# EAGLE schematic digital-logic _ analog (EAGLE 6.5.0)
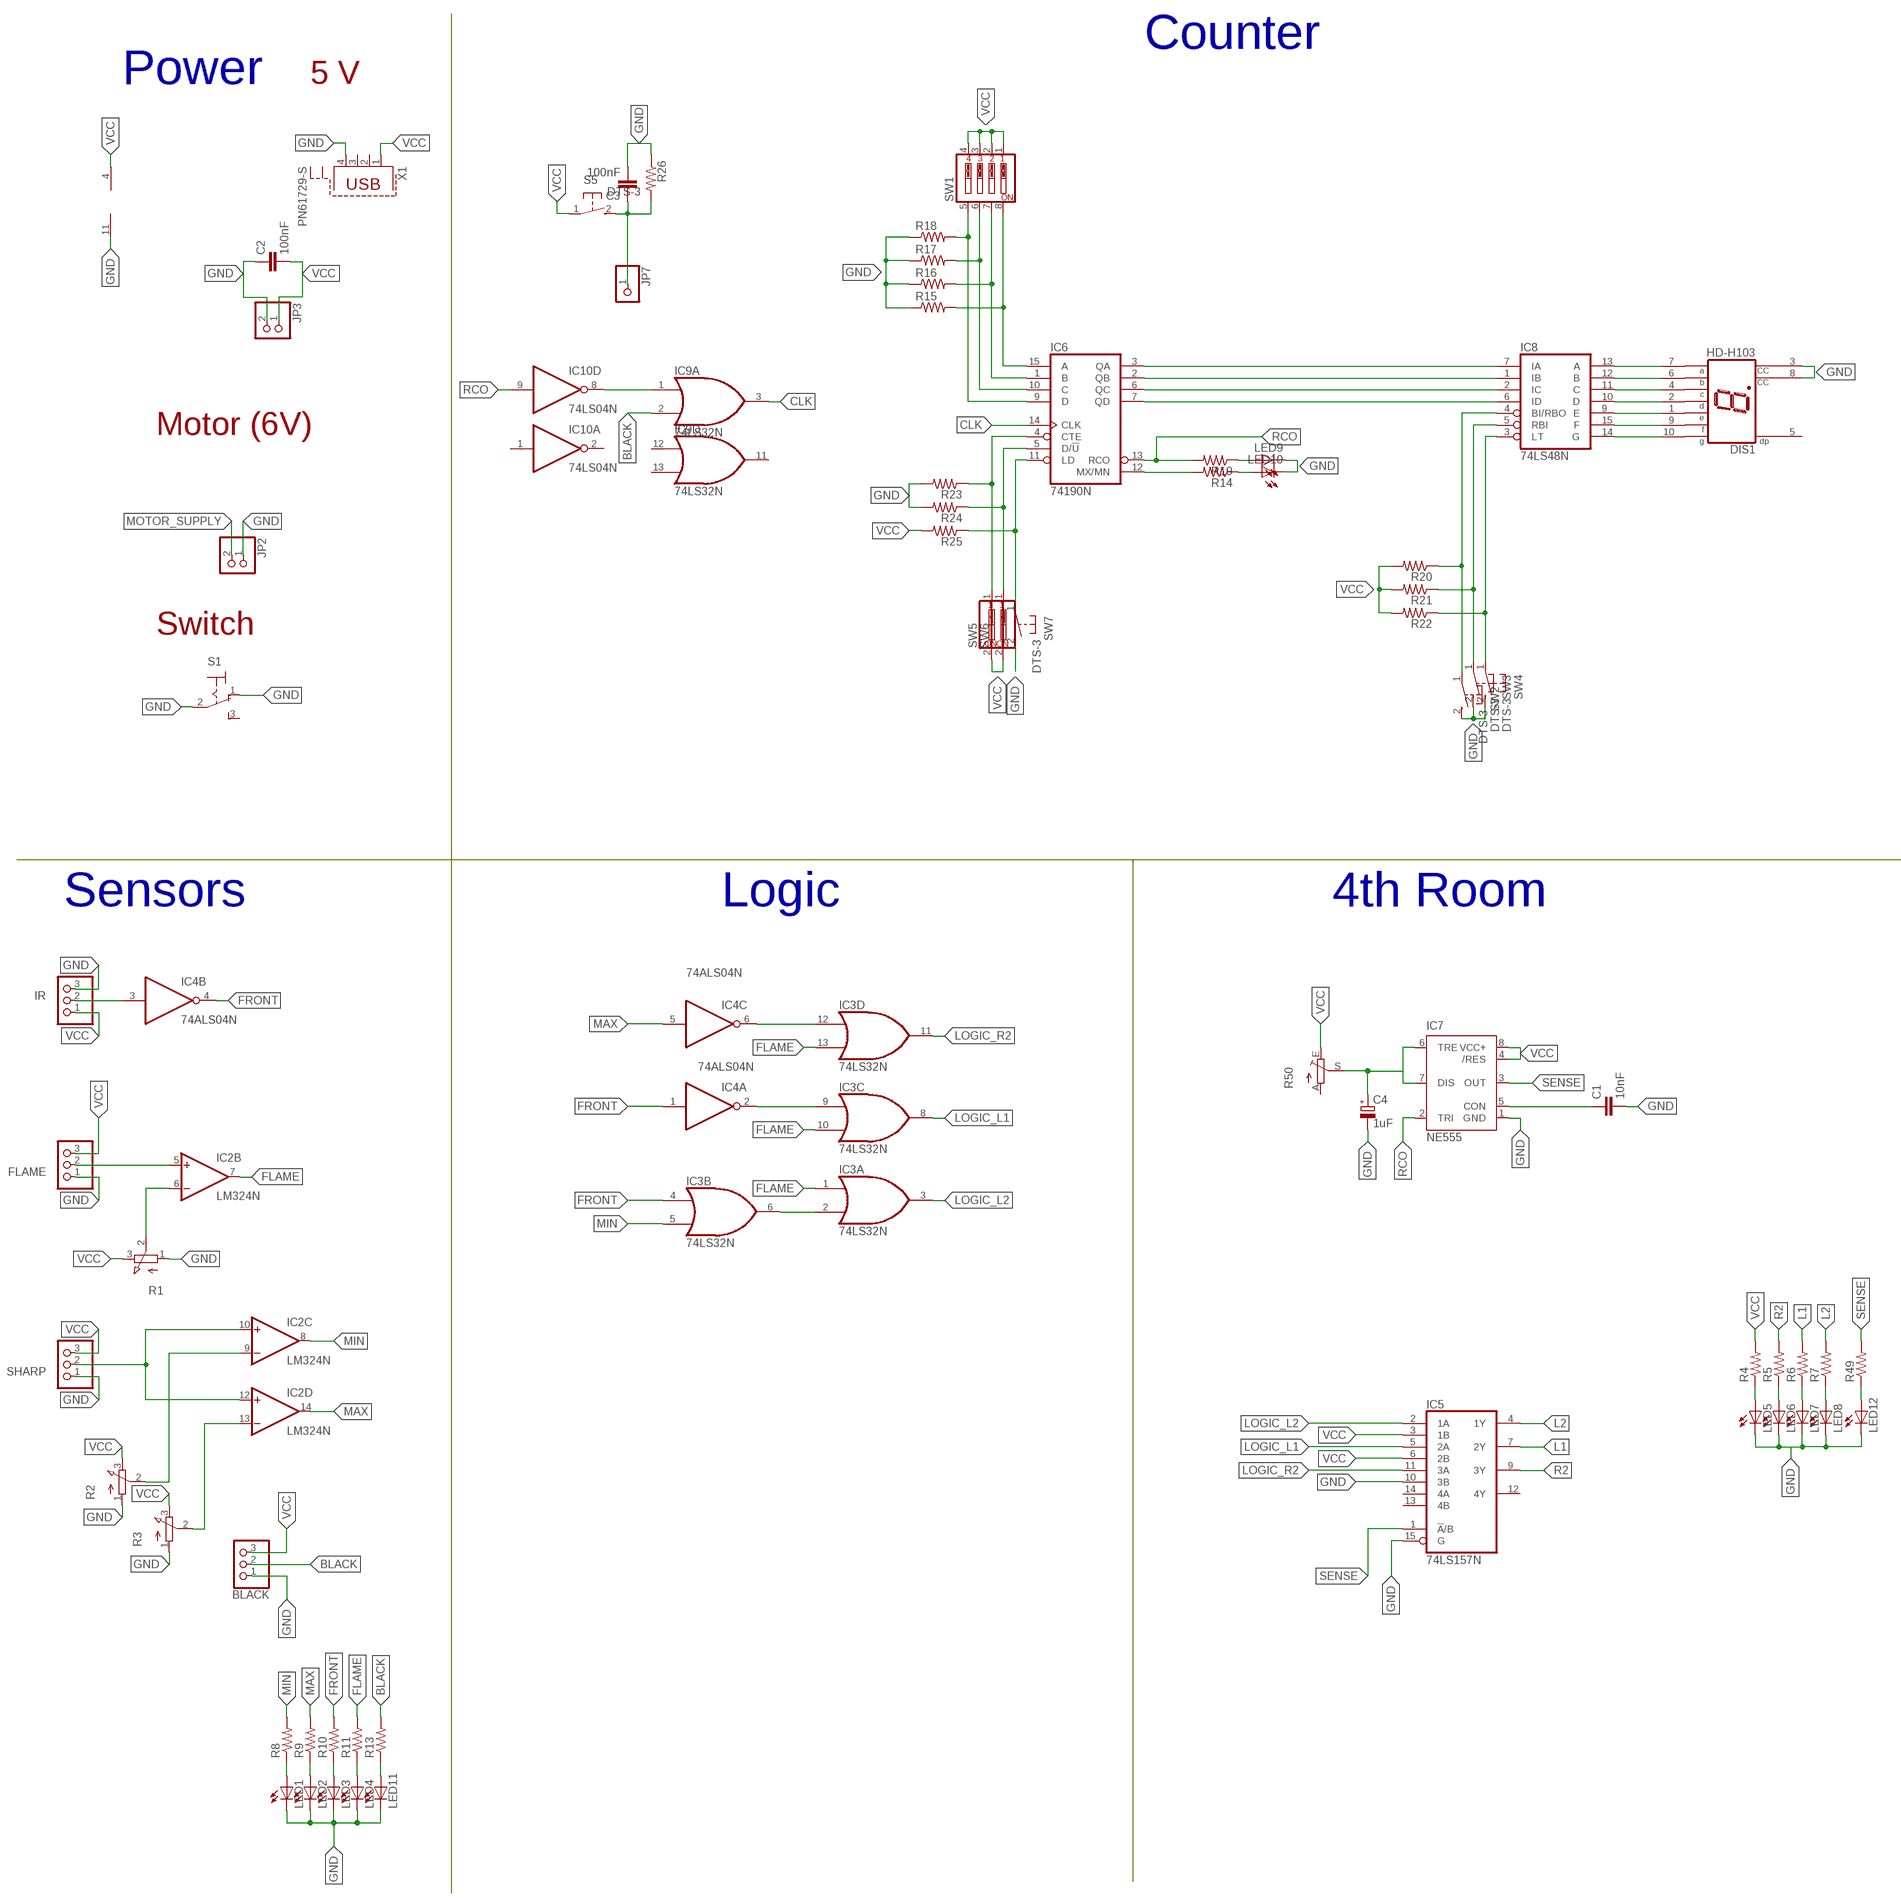
[diagram p0: schematic, sheet 1, part 1 of 2]
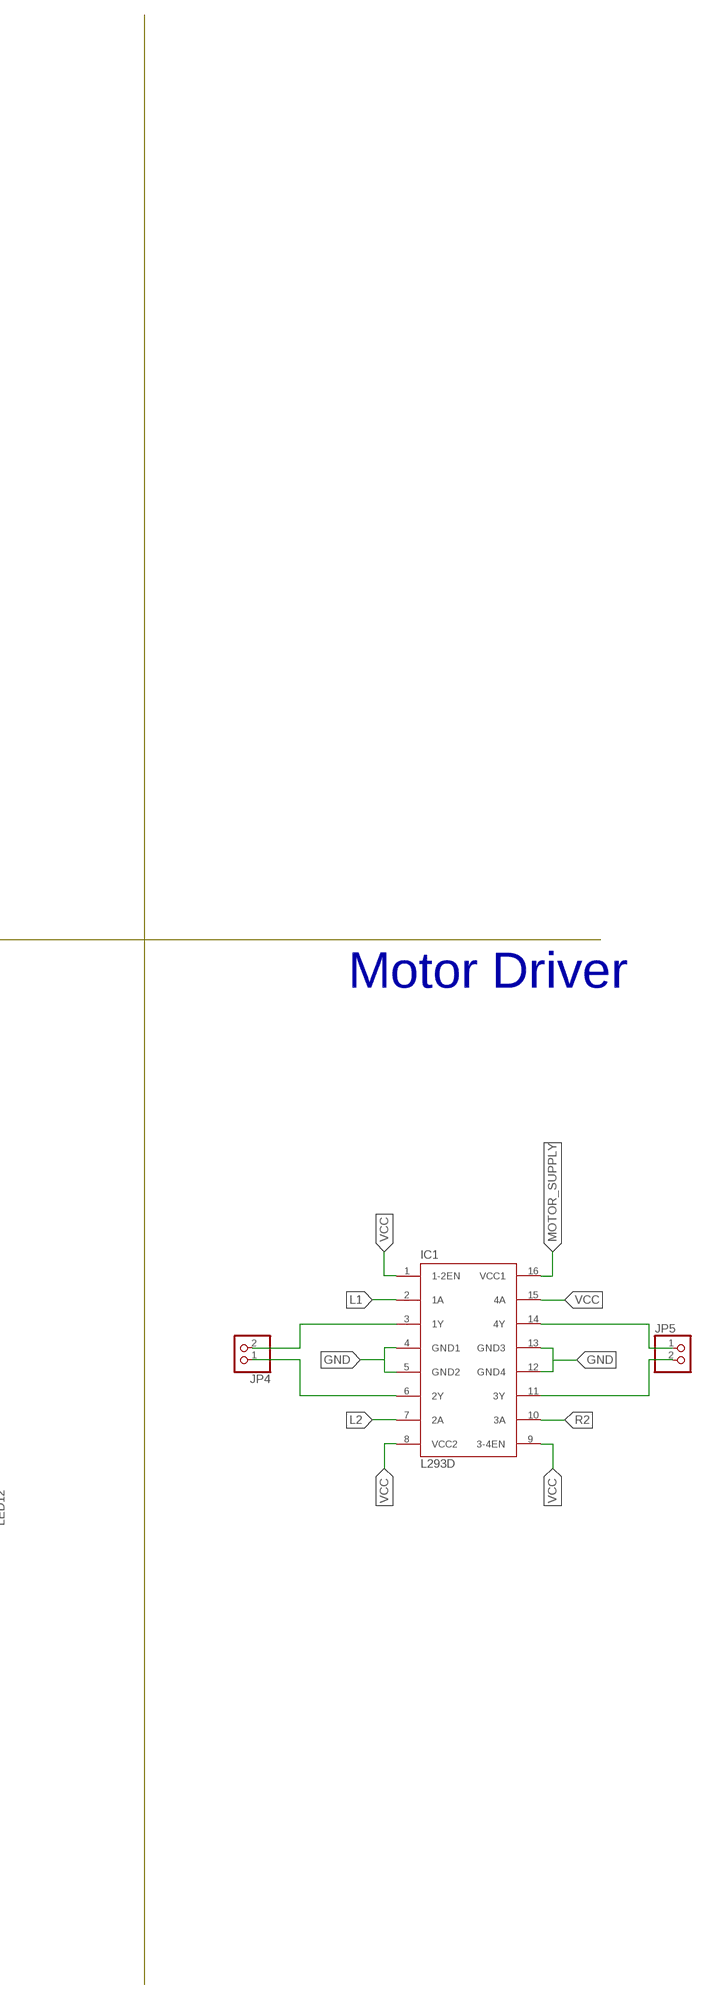
[diagram p1: schematic, sheet 1, part 2 of 2]

## Parts
BLACK  PINHD-1X3  [1X03]
C1  10nF  C-EU050-024X044  [C050-024X044]
C2  100nF  C-EU050-024X044  [C050-024X044]
C3  100nF  C-EU050-024X044  [C050-024X044]
C4  1uF  CPOL-EUE2.5-6  [E2,5-6]
DIS1  HD-H103  [HDSP-M]
FLAME  PINHD-1X3  [1X03]
IC1  L293D  [DIL16]
IC2  LM324N  [DIL14]
IC3  74LS32N  [DIL14]
IC4  74ALS04N  [DIL14]
IC5  74LS157N  [DIL16]
IC6  74190N  [DIL16]
IC7  NE555  [DIL-08]
IC8  74LS48N  [DIL16]
IC9  74LS32N  [DIL14]
IC10  74LS04N  [DIL14]
IR  PINHD-1X3  [1X03]
JP2  PINHD-1X2  [1X02]
JP3  PINHD-1X2  [1X02]
JP4  PINHD-1X2  [1X02]
JP5  PINHD-1X2  [1X02]
JP7  PINHD-1X1  [1X01]
LED1  LED5MM  [LED5MM]
LED2  LED5MM  [LED5MM]
LED3  LED5MM  [LED5MM]
LED4  LED5MM  [LED5MM]
LED5  LED5MM  [LED5MM]
LED6  LED5MM  [LED5MM]
LED7  LED5MM  [LED5MM]
LED8  LED5MM  [LED5MM]
LED9  LED5MM  [LED5MM]
LED10  LED5MM  [LED5MM]
LED11  LED5MM  [LED5MM]
LED12  LED5MM  [LED5MM]
R1  3RP/1610N  [3RP/1610N]
R2  3RP/1610N  [3RP/1610N]
R3  3RP/1610N  [3RP/1610N]
R4  R-US_0204/7  [0204/7]
R5  R-US_0204/7  [0204/7]
R6  R-US_0204/7  [0204/7]
R7  R-US_0204/7  [0204/7]
R8  R-US_0204/7  [0204/7]
R9  R-US_0204/7  [0204/7]
R10  R-US_0204/7  [0204/7]
R11  R-US_0204/7  [0204/7]
R13  R-US_0204/7  [0204/7]
R14  R-US_0204/7  [0204/7]
R15  R-US_0204/7  [0204/7]
R16  R-US_0204/7  [0204/7]
R17  R-US_0204/7  [0204/7]
R18  R-US_0204/7  [0204/7]
R19  R-US_0204/7  [0204/7]
R20  R-US_0204/7  [0204/7]
R21  R-US_0204/7  [0204/7]
R22  R-US_0204/7  [0204/7]
R23  R-US_0204/7  [0204/7]
R24  R-US_0204/7  [0204/7]
R25  R-US_0204/7  [0204/7]
R26  R-US_0204/7  [0204/7]
R49  R-US_0204/7  [0204/7]
R50  TRIM_EU-RJ9W  [RJ9W]
S1  320-916  [320-916]
S5  DTS-3  [DTS-3]
SHARP  PINHD-1X3  [1X03]
SW1  SW_DIP-4  [EDG-04]
SW2  DTS-3  [DTS-3]
SW3  DTS-3  [DTS-3]
SW4  DTS-3  [DTS-3]
SW5  SW_DIP-1  [EDG-01]
SW6  SW_DIP-1  [EDG-01]
SW7  DTS-3  [DTS-3]
X1  PN61729-S  [PN61729-S]

## Nets
BLACK: BLACK.2 IC9.2(A:I1) R13.2
CLK: IC6.14(CLK) IC9.3(A:O)
DIS: C4.+ IC7.6(TRE) IC7.7(DIS) R50.S
FLAME: IC2.7(B:OUT) IC3.1(A:I0) IC3.10(C:I1) IC3.13(D:I1) R11.2
FRONT: IC3.4(B:I0) IC4.1(A:I) IC4.4(B:O) R10.2
FRONT': IC4.3(B:I) IR.2
GND: BLACK.1 C1.2 C2.1 C3.2 C4.- DIS1.3(CC) DIS1.8(CC) FLAME.1 IC1.4(GND1) IC1.5(GND2) IC1.12(GND4) IC1.13(GND3) IC2.11(P:V-) IC5.10(3B) IC5.15(G) IC7.1(GND) IR.3 JP2.1 JP3.2 LED1.K(C) LED2.K(C) LED3.K(C) LED4.K(C) LED5.K(C) LED6.K(C) LED7.K(C) LED8.K(C) LED9.K(C) LED10.K(C) LED11.K(C) LED12.K(C) R1.1(A) R2.1(A) R3.1(A) R15.1 R16.1 R17.1 R18.1 R23.2 R24.2 R26.1 S1.1(O) S1.2(P) SHARP.1 SW2.2 SW3.2 SW4.2 SW7.2 X1.4
HAMADA: IC1.11(3Y) JP5.2
L1: IC1.2(1A) IC5.7(2Y) R6.2
L2: IC1.7(2A) IC5.4(1Y) R7.2
LOGIC_L1: IC3.8(C:O) IC5.5(2A)
LOGIC_L2: IC3.3(A:O) IC5.2(1A)
LOGIC_R2: IC3.11(D:O) IC5.11(3A)
MAX: IC2.14(D:OUT) IC4.5(C:I) R9.2
MIN: IC2.8(C:OUT) IC3.5(B:I1) R8.2
MOTOR_SUPPLY: IC1.16(VCC1) JP2.2
N$1: FLAME.2 IC2.5(B:+IN)
N$2: IC2.10(C:+IN) IC2.12(D:+IN) SHARP.2
N$3: LED5.A R4.1
N$4: IC3.12(D:I0) IC4.6(C:O)
N$5: IC2.6(B:-IN) R1.2(S)
N$6: C1.1 IC7.5(CON)
N$7: LED6.A R5.1
N$8: IC3.2(A:I1) IC3.6(B:O)
N$9: LED7.A R6.1
N$10: LED8.A R7.1
N$11: IC2.9(C:-IN) R2.2(S)
N$12: IC1.14(4Y) JP5.1
N$13: IC1.3(1Y) JP4.2
N$14: IC1.6(2Y) JP4.1
N$15: LED12.A R49.1
N$16: IC2.13(D:-IN) R3.2(S)
N$17: LED1.A R8.1
N$18: LED11.A R13.1
N$22: IC3.9(C:I0) IC4.2(A:O)
N$24: LED2.A R9.1
N$25: LED3.A R10.1
N$26: LED4.A R11.1
N$28: IC9.1(A:I0) IC10.8(D:O)
N$40: IC6.3(QA) IC8.7(IA)
N$41: IC6.2(QB) IC8.1(IB)
N$42: IC6.6(QC) IC8.2(IC)
N$43: IC6.7(QD) IC8.6(ID)
N$44: IC6.15(A) R15.2 SW1.8
N$45: IC6.1(B) R16.2 SW1.7
N$46: IC6.10(C) R17.2 SW1.6
N$47: IC6.9(D) R18.2 SW1.5
N$48: IC6.4(CTE) R23.1 SW5.1
N$49: IC6.5(D/!U) R24.1 SW6.1
N$50: IC6.11(LD) R25.1 SW7.1
N$51: IC8.4(BI/RBO) R20.1 SW2.1
N$52: IC8.5(RBI) R21.1 SW3.1
N$53: IC8.3(LT) R22.1 SW4.1
N$54: DIS1.7(A) IC8.13(A)
N$55: DIS1.6(B) IC8.12(B)
N$56: DIS1.4(C) IC8.11(C)
N$57: DIS1.2(D) IC8.10(D)
N$58: DIS1.1(E) IC8.9(E)
N$59: DIS1.9(F) IC8.15(F)
N$60: DIS1.10(G) IC8.14(G)
N$62: IC6.12(MX/MN) R14.2
N$63: LED9.A R19.1
N$64: LED10.A R14.1
N$65: C3.1 JP7.1 R26.2 S5.2
R2: IC1.10(3A) IC5.9(3Y) R5.2
RCO: IC6.13(RCO) IC7.2(TRI) IC10.9(D:I) R19.2
SENSE: IC5.1(!A!/B) IC7.3(OUT) R49.2
VCC: BLACK.3 C2.2 FLAME.3 IC1.1(1-2EN) IC1.8(VCC2) IC1.9(3-4EN) IC1.15(4A) IC2.4(P:V+) IC5.3(1B) IC5.6(2B) IC7.4(/RES) IC7.8(VCC+) IR.1 JP3.1 R1.3(E) R2.3(E) R3.3(E) R4.2 R20.2 R21.2 R22.2 R25.2 R50.E S5.1 SHARP.3 SW1.1 SW1.2 SW1.3 SW1.4 SW5.2 SW6.2 X1.1
Unconnected: DIS1.5(DP) IC2.1(A:OUT) IC2.2(A:-IN) IC2.3(A:+IN) IC4.8(D:O) IC4.9(D:I) IC4.10(E:O) IC4.11(E:I) IC4.12(F:O) IC4.13(F:I) IC5.12(4Y) IC5.13(4B) IC5.14(4A) IC9.4(B:I0) IC9.5(B:I1) IC9.6(B:O) IC9.8(C:O) IC9.9(C:I0) IC9.10(C:I1) IC9.11(D:O) IC9.12(D:I0) IC9.13(D:I1) IC10.1(A:I) IC10.2(A:O) IC10.3(B:I) IC10.4(B:O) IC10.5(C:I) IC10.6(C:O) IC10.10(E:O) IC10.11(E:I) IC10.12(F:O) IC10.13(F:I) R50.A S1.3(S) X1.2 X1.3 X1.S1 X1.S2

## Notes on the sheet
- Counter
- Power | 5 V
- Motor (6V)
- Switch
- Sensors | Logic | 4th Room | Motor Driver

## Power pins joined to a net without a drawn wire
GND: IC3.7(P:GND) IC4.7(P:GND) IC5.8(GND) IC6.8(GND) IC8.8(GND) IC9.7(P:GND) IC10.7(P:GND)
VCC: IC3.14(P:VCC) IC4.14(P:VCC) IC5.16(VCC) IC6.16(VCC) IC8.16(VCC) IC9.14(P:VCC) IC10.14(P:VCC)

## Library data of the parts
BLACK FLAME IR SHARP = pinhead:PINHD-1X3: PIN HEADER
C1-C3 = rcl:C-EU: CAPACITOR, European symbol
C4 = rcl:CPOL-EU: POLARIZED CAPACITOR, European symbol
DIS1 = display-hp:HD-H103: LED DISPLAY 1-character 7 segment, decimal point right; OC_FARNELL: unknown; OC_NEWARK: unknown
IC1 = st-microelectronics:L293D: PUSH-PULL 4 CHANNEL DRIVER; MPN: L293D; OC_FARNELL: 9589619; OC_NEWARK: 56P8249
IC2 = linear:LM324: OP AMP
IC3 IC9 = 74xx-us:74*32: Quad 2-input OR gate
IC4 IC10 = 74xx-us:74*04: Hex INVERTER
IC5 = 74xx-us:74*157: Quadruple 2-line to 1-line data SELECTOR/MULTIPLEXER
IC6 = 74xx-us:74*190: Synchronous UP/DOWN COUNTER
IC7 = st-microelectronics:NE555: General purpose bipolar Timer; MF: Arrow Electronics; MPN: NE555N; OC_FARNELL: 1467742; OC_NEWARK: 89K1486
IC8 = 74xx-us:74*48: BCD to seven segment DECODER/DRIVER
JP2-JP5 = pinhead:PINHD-1X2: PIN HEADER
JP7 = pinhead:PINHD-1X1: PIN HEADER
LED1-LED12 = led:LED: LED OSRAM: - CHIPLED LG R971, LG N971, LY N971, LG Q971, LY Q971, LO R971, LY R971 LH N974, LH R974 LS Q976, LO Q976, LY Q976 LO Q996 - Hyper CHIPLED LW Q18S LB Q993, LB Q99A, LB R99A - SideLED LS A670, LO A670, LY A670, LG A670, LP A670 LB A673, LV A673, LT A673, LW A673 LH A674 LY A675 LS A676, LA A676, LO A676, LY A676, LW A676 LS A679, LY A679, LG A679 - Hyper Micro SIDELED® LS Y876, LA Y876, LO Y876, LY Y876 LT Y87S - SmartLED LW L88C, LW L88S LB L89C, LB L89S, LG L890 LS L89K, LO L89K, LY L89K LS L896, LA L896, LO L896, LY L896 - TOPLED LS T670, LO T670, LY T670, LG T670, LP T670 LSG T670, LSP T670, LSY T670, LOP T670, LYG T670 LG T671, LOG T671, LSG T671 LB T673, LV T673, LT T673, LW T673 LH T674 LS T676, LA T676, LO T676, LY T676, LB T676, LH T676, LSB T676, LW T676 LB T67C, LV T67C, LT T67C, LS T67K, LO T67K, LY T67K, LW E67C LS E67B, LA E67B, LO E67B, LY E67B, LB E67C, LV E67C, LT E67C LW T67C LS T679, LY T679, LG T679 LS T770, LO T770, LY T770, LG T770, LP T770 LB T773, LV T773, LT T773, LW T773 LH T774 LS E675, LA E675, LY E675, LS T675 LS T776, LA T776, LO T776, LY T776, LB T776 LHGB T686 LT T68C, LB T68C - Hyper Mini TOPLED® LB M676 - Mini TOPLED Santana® LG M470 LS M47K, LO M47K, LY M47K Source: http://www.osram.convergy.de LUXEON: - LUMILED® LXK2-PW12-R00, LXK2-PW12-S00, LXK2-PW14-U00, LXK2-PW14-V00 LXK2-PM12-R00, LXK2-PM12-S00, LXK2-PM14-U00 LXK2-PE12-Q00, LXK2-PE12-R00, LXK2-PE12-S00, LXK2-PE14-T00, LXK2-PE14-U00 LXK2-PB12-K00, LXK2-PB12-L00, LXK2-PB12-M00, LXK2-PB14-N00, LXK2-PB14-P00, LXK2-PB14-Q00 LXK2-PR12-L00, LXK2-PR12-M00, LXK2-PR14-Q00, LXK2-PR14-R00 LXK2-PD12-Q00, LXK2-PD12-R00, LXK2-PD12-S00 LXK2-PH12-R00, LXK2-PH12-S00 LXK2-PL12-P00, LXK2-PL12-Q00, LXK2-PL12-R00 Source: www.luxeon.com KINGBRIGHT: KA-3528ASYC Source: www.kingbright.com
R1-R3 = pot:3RP/1610N: 16mm Potentiometer one level Source: http://www.alphapotentiometers.net/html/16mm_pot_2.html
R4-R11 R13-R26 R49 = rcl:R-US_: RESISTOR, American symbol
R50 = pot:TRIM_EU-: POTENTIOMETER
S1 = switch:320-916: TOGGLE SWITCH distributor RS Components
S5 SW2-SW4 SW7 = switch-tact:DTS-3
SW1 = special:SW_DIP-4: DIP SWITCH
SW5 SW6 = special:SW_DIP-1: DIP SWITCH
X1 = con-berg:PN61729-S: BERG USB connector; OC_FARNELL: unknown; OC_NEWARK: unknown